# Altium project Handheld99.PrjPcb (part 3 of 3)
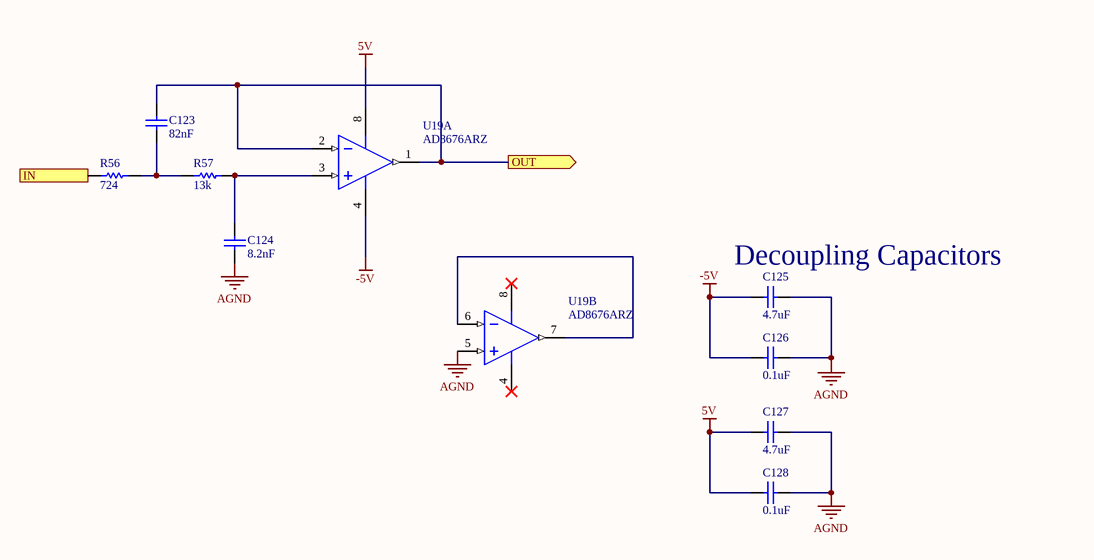
[diagram p38: 600Hz_LO_LPF.SchDoc]

## Nets that join several sheets
1V8d: top_level (TP47.1), LO1 (35 pins), LO2 (35 pins), 1v8_Regulator (C92.2 U16.2)
2V5: top_level (TP18.1), adc (C46.1 U9.2), 2v5_Regulator (C89.2 U13.3)
3V3: top_level (TP44.1), mcu (29 pins), LO1 (U10_LO1.49), LO2 (U10_LO2.49), RADIO (P16.4), 3v3_Regulator (C86.2 U12.3), Batt_Charger (R32.2 R33.2 R45.2), ZIF_Bridge (J5.02)
3V3_2: adc (C47.1 U9.15), ZIF_Bridge (J9.09)
5V: top_level (TP20.1), buffer (C44.1 C45.1 U8.7), ina (C18.1 C19.1 U3.7), HP (C24_HP.1 C25_HP.1 U5_HP.6), MIXER1 (C64_MIXER1.1 C65_MIXER1.1 U14_MIXER1.11), HP2 (C24_HP2.1 C25_HP2.1 U5_HP2.6), AMP1 (C22_AMP1.1 C23_AMP1.1 U4_AMP1.7), dcshift (C68.1 C69.1 R14.3 U15.7), LPF_ADC (C103.1 C104.1 U21.8), MIXER2 (C64_MIXER2.1 C65_MIXER2.1 U14_MIXER2.11), low_pass (C34.1 C36.1 U6.8), ADC_Reference (C84.2 U11.1 U11.2), 2v5_Regulator (C88.1 U13.1 U13.2), 5v_Regulator (C94.1 U17.2 U17.4), AMP2 (C22_AMP2.1 C23_AMP2.1 U4_AMP2.7), LO1_LPF (C121_LO1_LPF.1 C122_LO1_LPF.1 U7_LO1_LPF.8), LO1_HPF (C121_LO1_HPF.1 C122_LO1_HPF.1 U7_LO1_HPF.8), 600Hz_LO_LPF (C127.1 C128.1 U19.8), LO2_HPF (C121_LO2_HPF.1 C122_LO2_HPF.1 U7_LO2_HPF.8)
5Vd: top_level (TP46.1), dcshift1 (C153_dcshift1.1 C154_dcshift1.1 R15_dcshift1.3 U30_dcshift1.7), dcshift2 (C153_dcshift2.1 C154_dcshift2.1 R15_dcshift2.3 U30_dcshift2.7), LO1_INA1 (C157_LO1_INA1.1 C158_LO1_INA1.1 U31_LO1_INA1.7), LO1_INA2 (C157_LO1_INA2.1 C158_LO1_INA2.1 U31_LO1_INA2.7), LO2_INA1 (C157_LO2_INA1.1 C158_LO2_INA1.1 U31_LO2_INA1.7), LO2_INA2 (C157_LO2_INA2.1 C158_LO2_INA2.1 U31_LO2_INA2.7), 50Hz_GEN_LPF (C109.1 C110.1 U22.8), 5kHz_GEN_LPF (C115.1 C116.1 U23.8), 5v_Reg_biggr (C147.1 U28.2), 1v8_Regulator (C91.2 U16.3)
24V: top_level (J13.02 J13.04), 3v3_Regulator (C87.2 U12.1), Large Relay 2 (K1_Large_Relay_2.4), 5v_Reg_biggr (C148.1 U28.1)
24V_548: top_level (TP49.1), OPA5481 (5 pins), OPA5482 (5 pins), Large Relay 2 (K1_Large_Relay_2.3)
-5V: top_level (TP28.1), buffer (C42.1 C43.1 U8.4), ina (C16.1 C17.1 U3.4), HP (C26_HP.1 C27_HP.1 U5_HP.2), MIXER1 (C62_MIXER1.1 C63_MIXER1.1 U14_MIXER1.8), HP2 (C26_HP2.1 C27_HP2.1 U5_HP2.2), AMP1 (C20_AMP1.1 C21_AMP1.1 U4_AMP1.4), dcshift (C66.1 C67.1 U15.4), LPF_ADC (C101.1 C102.1 U21.4), MIXER2 (C62_MIXER2.1 C63_MIXER2.1 U14_MIXER2.8), low_pass (C30.1 C32.1 U6.4), -5v_Regulator (C95.2 U20.1), AMP2 (C20_AMP2.1 C21_AMP2.1 U4_AMP2.4), LO1_LPF (C119_LO1_LPF.1 C120_LO1_LPF.1 U7_LO1_LPF.4), LO1_HPF (C119_LO1_HPF.1 C120_LO1_HPF.1 U7_LO1_HPF.4), 600Hz_LO_LPF (C125.1 C126.1 U19.4), LO2_HPF (C119_LO2_HPF.1 C120_LO2_HPF.1 U7_LO2_HPF.4)
-5Vd: top_level (TP53.1), dcshift1 (C151_dcshift1.1 C152_dcshift1.1 U30_dcshift1.4), dcshift2 (C151_dcshift2.1 C152_dcshift2.1 U30_dcshift2.4), LO1_INA1 (C155_LO1_INA1.1 C156_LO1_INA1.1 U31_LO1_INA1.4), LO1_INA2 (C155_LO1_INA2.1 C156_LO1_INA2.1 U31_LO1_INA2.4), LO2_INA1 (C155_LO2_INA1.1 C156_LO2_INA1.1 U31_LO2_INA1.4), LO2_INA2 (C155_LO2_INA2.1 C156_LO2_INA2.1 U31_LO2_INA2.4), 50Hz_GEN_LPF (C107.1 C108.1 U22.4), 5kHz_GEN_LPF (C113.1 C114.1 U23.4), -5v_Reg_biggr (C150.2 U24.3)
-24V_548_HF: top_level (TP48.1), OPA5482 (7 pins), Large Relay 1 (K1_Large_Relay_1.4)
-24V_548_LF: top_level (TP50.1), OPA5481 (7 pins), Large Relay 3 (K1_Large_Relay_3.4)
-24V_HF: top_level (J13.05 J13.06), Large Relay 1 (K1_Large_Relay_1.3), -5v_Reg_biggr (C159.2 U24.2)
-24V_LF: top_level (J13.01 J13.03), Large Relay 3 (K1_Large_Relay_3.3)
AGND: top_level (R4.1 TP25.1), buffer (C42.2 C43.2 C44.2 C45.2), adc (10 pins), ina (5 pins), HP (6 pins), MIXER1 (8 pins), HP2 (6 pins), AMP1 (5 pins), dcshift (5 pins), LPF_ADC (6 pins), MIXER2 (8 pins), low_pass (6 pins), ADC_Reference (6 pins), 2v5_Regulator (7 pins), 5v_Regulator (C94.2 U17.1), -5v_Regulator (C95.1 U20.3), AMP2 (5 pins), Small Relay 1 (R46_Small_Relay_1.1), Small Relay 2 (R46_Small_Relay_2.1), LO1_LPF (6 pins), LO1_HPF (6 pins), 600Hz_LO_LPF (6 pins), LO2_HPF (6 pins)
GND: top_level (6 pins), mcu (41 pins), dcshift1 (5 pins), OPA5481 (8 pins), mechanical (10 pins), dcshift2 (5 pins), OPA5482 (8 pins), LO1 (32 pins), LO2 (32 pins), RADIO (P16.3), LO1_INA1 (5 pins), LO1_INA2 (5 pins), LO2_INA1 (5 pins), LO2_INA2 (5 pins), 50Hz_GEN_LPF (6 pins), 5kHz_GEN_LPF (6 pins), 3v3_Regulator (C86.1 C87.1 U12.2), Power_Input (J6.01 J6.03 J6.05), Batt_Charger (U25.2 U25.3 U25.7 U25.9), Large Relay 1 (R61_Large_Relay_1.1), Large Relay 2 (R61_Large_Relay_2.1), Negative DC-DC (18 pins), Negative DC-DC (18 pins), 24V_Regulator (C145.2 C146.2 C149.2 R65.1), 5v_Reg_biggr (C147.2 C148.2 U28.3), -5v_Reg_biggr (C150.1 C159.1 U24.1), Large Relay 3 (R61_Large_Relay_3.1), ZIF_Bridge (J5.01), 1v8_Regulator (C91.1 C92.1 U16.1)
GND_2: top_level (R4.2), adc (C47.2), ZIF_Bridge (J9.10)
REF: top_level (TP19.1), adc (C49.2 U9.7 U9.8), ADC_Reference (C85.2 U11.6 U11.7)
ADC_CONV: mcu (U1.43), ZIF_Bridge (J5.03)
ADC_SCK: mcu (U1.41), ZIF_Bridge (J5.05)
ADC_SDO: mcu (U1.42), ZIF_Bridge (J5.04)
ALCC: mcu (U1.135), Batt_Charger (R32.1 U25.6)
~{BUSY}: mcu (U1.40), ZIF_Bridge (J5.06)
~{CS}: mcu (U1.46), LO2 (U10_LO2.47)
~{CS}: mcu (U1.47), LO1 (U10_LO1.47)
IO_UPDATE: mcu (U1.117), LO2 (U10_LO2.46)
IO_UPDATE: mcu (U1.80), LO1 (U10_LO1.46)
NetC28_HP2_1: top_level (TP5.1), MIXER1 (U14_MIXER1.13), HP2 (C28_HP2.1)
NetC28_HP_1: top_level (TP1.1), ina (U3.6), HP (C28_HP.1)
NetC31_2: top_level (C31.2), OPA5481 (R26_OPA5481.2 U19__OPA5481.6)
NetC33_2: top_level (C33.2), OPA5482 (R26_OPA5482.2 U19__OPA5482.6)
NetC38_2: top_level (TP7.1), AMP1 (R9_AMP1.1), low_pass (C38.2 U6.1 U6.2)
NetC50_1: top_level (C50.1 C51.1 P2.1), ina (U3.2)
NetC50_2: top_level (C50.2 C51.2 P2.2), ina (U3.3)
NetC93_1: 5v_Regulator (C93.1 U17.3), Small Relay 1 (K2_Small_Relay_1.3)
NetC93_2: top_level (J1.3 J2.1 TP27.1), 5v_Regulator (C93.2), -5v_Regulator (C96.2 U20.2 U20.4)
NetC96_1: -5v_Regulator (C96.1), Small Relay 2 (K2_Small_Relay_2.4)
NetC98_Negative_DC-DC#1_2: top_level (J12.01 J12.03 TP32.1), Negative DC-DC (C98_Negative_DC-DC#1.2 C132_Negative_DC-DC#1.2 R39_Negative_DC-DC#1.2 U18_Negative_DC-DC#1.3)
NetC98_Negative_DC-DC#2_2: top_level (J12.05 J12.06 TP51.1), Negative DC-DC (C98_Negative_DC-DC#2.2 C132_Negative_DC-DC#2.2 R39_Negative_DC-DC#2.2 U18_Negative_DC-DC#2.3)
NetC99_2: top_level (R1.2 TP10.1), buffer (U8.3), LPF_ADC (C99.2 U21.1 U21.2)
NetC105_2: top_level (TP33.1), OPA5481 (R41_OPA5481.1), 50Hz_GEN_LPF (C105.2 U22.1 U22.2)
NetC111_2: top_level (TP38.1), OPA5482 (R41_OPA5482.1), 5kHz_GEN_LPF (C111.2 U23.1 U23.2)
NetC117_LO1_HPF_2: LO1_LPF (R54_LO1_LPF.1), LO1_HPF (C117_LO1_HPF.2 U7_LO1_HPF.1 U7_LO1_HPF.2)
NetC117_LO1_LPF_2: top_level (TP13.1), MIXER1 (S2_MIXER1.3 S2_MIXER1.4), LO1_LPF (C117_LO1_LPF.2 U7_LO1_LPF.1 U7_LO1_LPF.2)
NetC117_LO2_HPF_2: 600Hz_LO_LPF (R56.1), LO2_HPF (C117_LO2_HPF.2 U7_LO2_HPF.1 U7_LO2_HPF.2)
NetC123_2: top_level (TP14.1), MIXER2 (S2_MIXER2.3 S2_MIXER2.4), 600Hz_LO_LPF (C123.2 U19.1 U19.2)
NetC130_Negative_DC-DC#1_2: top_level (D1.2 TP45.1), Power_Input (J6.02 J6.04 J6.06), Negative DC-DC (5 pins), Negative DC-DC (5 pins), 24V_Regulator (C146.1 U27.3)
NetC145_1: top_level (J12.02 J12.04 TP17.1), 24V_Regulator (C145.1 R64.2 U27.2)
NetJ2_3: top_level (J2.3 TP29.1), Small Relay 2 (K2_Small_Relay_2.3)
NetJ5_07: top_level (TP23.1), LO1_INA1 (U31_LO1_INA1.6), ZIF_Bridge (J5.07)
NetJ5_08: top_level (TP22.1), LO2_INA1 (U31_LO2_INA1.6), ZIF_Bridge (J5.08)
NetJ5_09: top_level (TP36.1), mcu (U1.97), ZIF_Bridge (J5.09)
NetJ5_10: top_level (TP37.1), mcu (U1.45), ZIF_Bridge (J5.10)
NetJ9_01: top_level (TP15.1), Small Relay 1 (K2_Small_Relay_1.1), ZIF_Bridge (J9.01)
NetJ9_02: top_level (TP26.1), Small Relay 2 (K2_Small_Relay_2.1), ZIF_Bridge (J9.02)
NetJ9_03: ZIF_Bridge (J9.03), LO2_HPF (R54_LO2_HPF.1)
NetJ9_04: ZIF_Bridge (J9.04), LO1_HPF (R54_LO1_HPF.1)
NetJ9_05: adc (U9.11), ZIF_Bridge (J9.05)
NetJ9_06: adc (U9.13), ZIF_Bridge (J9.06)
NetJ9_07: adc (U9.14), ZIF_Bridge (J9.07)
NetJ9_08: adc (U9.9), ZIF_Bridge (J9.08)
NetJ14_02: top_level (J14.02 J14.04 J14.06 TP16.1), Small Relay 1 (K2_Small_Relay_1.4)
NetK1_Large_Relay_1_2: top_level (TP43.1), mcu (U1.44), Large Relay 1 (K1_Large_Relay_1.2)
NetK1_Large_Relay_2_2: top_level (TP42.1), mcu (U1.98), Large Relay 2 (K1_Large_Relay_2.2)
NetK1_Large_Relay_3_2: top_level (TP41.1), mcu (U1.96), Large Relay 3 (K1_Large_Relay_3.2)
NetR1_1: top_level (R1.1 R16.2 TP11.1), LPF_ADC (R48.1), AMP2 (R8_AMP2.2 U4_AMP2.6)
NetR2_1: top_level (R2.1 TP4.1), AMP1 (R8_AMP1.2 U4_AMP1.6), MIXER2 (U14_MIXER2.1 U14_MIXER2.16)
NetR2_2: top_level (R2.2 R3.1 TP3.1), dcshift (R21.1), MIXER2 (U14_MIXER2.13)
NetR3_2: top_level (R3.2 R16.1 TP9.1), dcshift (R20.2 U15.6), AMP2 (R9_AMP2.1)
NetR10_HP2_2: top_level (TP6.1), HP2 (R10_HP2.2 U5_HP2.1 U5_HP2.4), low_pass (R12.1)
NetR10_HP_2: top_level (TP2.1), HP (R10_HP.2 U5_HP.1 U5_HP.4), MIXER1 (U14_MIXER1.1 U14_MIXER1.16)
NetR17_1: top_level (R17.1 TP34.1), dcshift1 (R66_dcshift1.2 U30_dcshift1.6), 50Hz_GEN_LPF (R50.1)
NetR17_2: top_level (R17.2 TP24.1 TP35.1), dcshift1 (R67_dcshift1.1), LO2_INA2 (U31_LO2_INA2.6)
NetR18_1: top_level (R18.1 TP39.1), dcshift2 (R66_dcshift2.2 U30_dcshift2.6), 5kHz_GEN_LPF (R52.1)
NetR18_2: top_level (R18.2 TP21.1 TP40.1), dcshift2 (R67_dcshift2.1), LO1_INA2 (U31_LO1_INA2.6)
NetR19_LO1_1: LO1 (R19_LO1.1 U10_LO1.8), LO1_INA2 (U31_LO1_INA2.3)
NetR19_LO2_1: LO2 (R19_LO2.1 U10_LO2.8), LO2_INA2 (U31_LO2_INA2.3)
NetR27_LO1_1: LO1 (R27_LO1.1 U10_LO1.9), LO1_INA2 (U31_LO1_INA2.2)
NetR27_LO2_1: LO2 (R27_LO2.1 U10_LO2.9), LO2_INA2 (U31_LO2_INA2.2)
NetR28_LO1_1: LO1 (R28_LO1.1 U10_LO1.13), LO1_INA1 (U31_LO1_INA1.3)
NetR28_LO2_1: LO2 (R28_LO2.1 U10_LO2.13), LO2_INA1 (U31_LO2_INA1.3)
NetR29_LO1_1: LO1 (R29_LO1.1 U10_LO1.14), LO1_INA1 (U31_LO1_INA1.2)
NetR29_LO2_1: LO2 (R29_LO2.1 U10_LO2.14), LO2_INA1 (U31_LO2_INA1.2)
NetR40_1: top_level (TP12.1), buffer (U8.2 U8.6), adc (R40.1)
P0: mcu (U1.118), LO2 (U10_LO2.40)
P0: mcu (U1.81), LO1 (U10_LO1.40)
P1: mcu (U1.119), LO2 (U10_LO2.41)
P1: mcu (U1.82), LO1 (U10_LO1.41)
P2: mcu (U1.122), LO2 (U10_LO2.42)
P2: mcu (U1.85), LO1 (U10_LO1.42)
P3: mcu (U1.123), LO2 (U10_LO2.43)
P3: mcu (U1.86), LO1 (U10_LO1.43)
RADIO_RX: mcu (U1.78), RADIO (P16.1 TP8.1)
RADIO_TX: mcu (U1.77), RADIO (P16.2 TP54.1)
RESET: mcu (U1.116), LO2 (R37_LO2.2 U10_LO2.3)
RESET: mcu (U1.79), LO1 (R37_LO1.2 U10_LO1.3)
SCL: mcu (U1.136), Batt_Charger (R45.1 U25.4)
SCLK: mcu (U1.69), LO1 (U10_LO1.48), LO2 (U10_LO2.48)
SDA: mcu (U1.140), Batt_Charger (R33.1 U25.5)
SDIO_0: mcu (U1.27), LO1 (U10_LO1.50), LO2 (U10_LO2.50)
SDIO_1: mcu (U1.73), LO1 (U10_LO1.51)
SDIO_1: mcu (U1.114), LO2 (U10_LO2.51)
SDIO_2: mcu (U1.28), LO1 (U10_LO1.52), LO2 (U10_LO2.52)
SDIO_3: mcu (U1.74), LO1 (U10_LO1.53)
SDIO_3: mcu (U1.115), LO2 (U10_LO2.53)
USART1_RX: top_level (P1.3 TP31.1), mcu (U1.76)
USART1_TX: top_level (P1.2 TP30.1), mcu (U1.75)